# Altium schematic sheet Template A4.SchDoc
size 292 x 193 mm
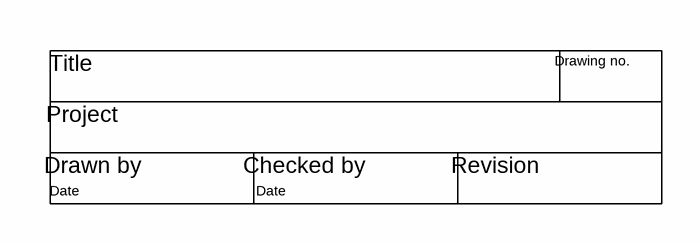
[diagram p0: Template A4.SchDoc]

## Notes on the sheet
- Title
- Project
- Drawing no.
- Date
- Drawn by
- Checked by
- Revision